# EAGLE schematic se2 (EAGLE 7.2.0)
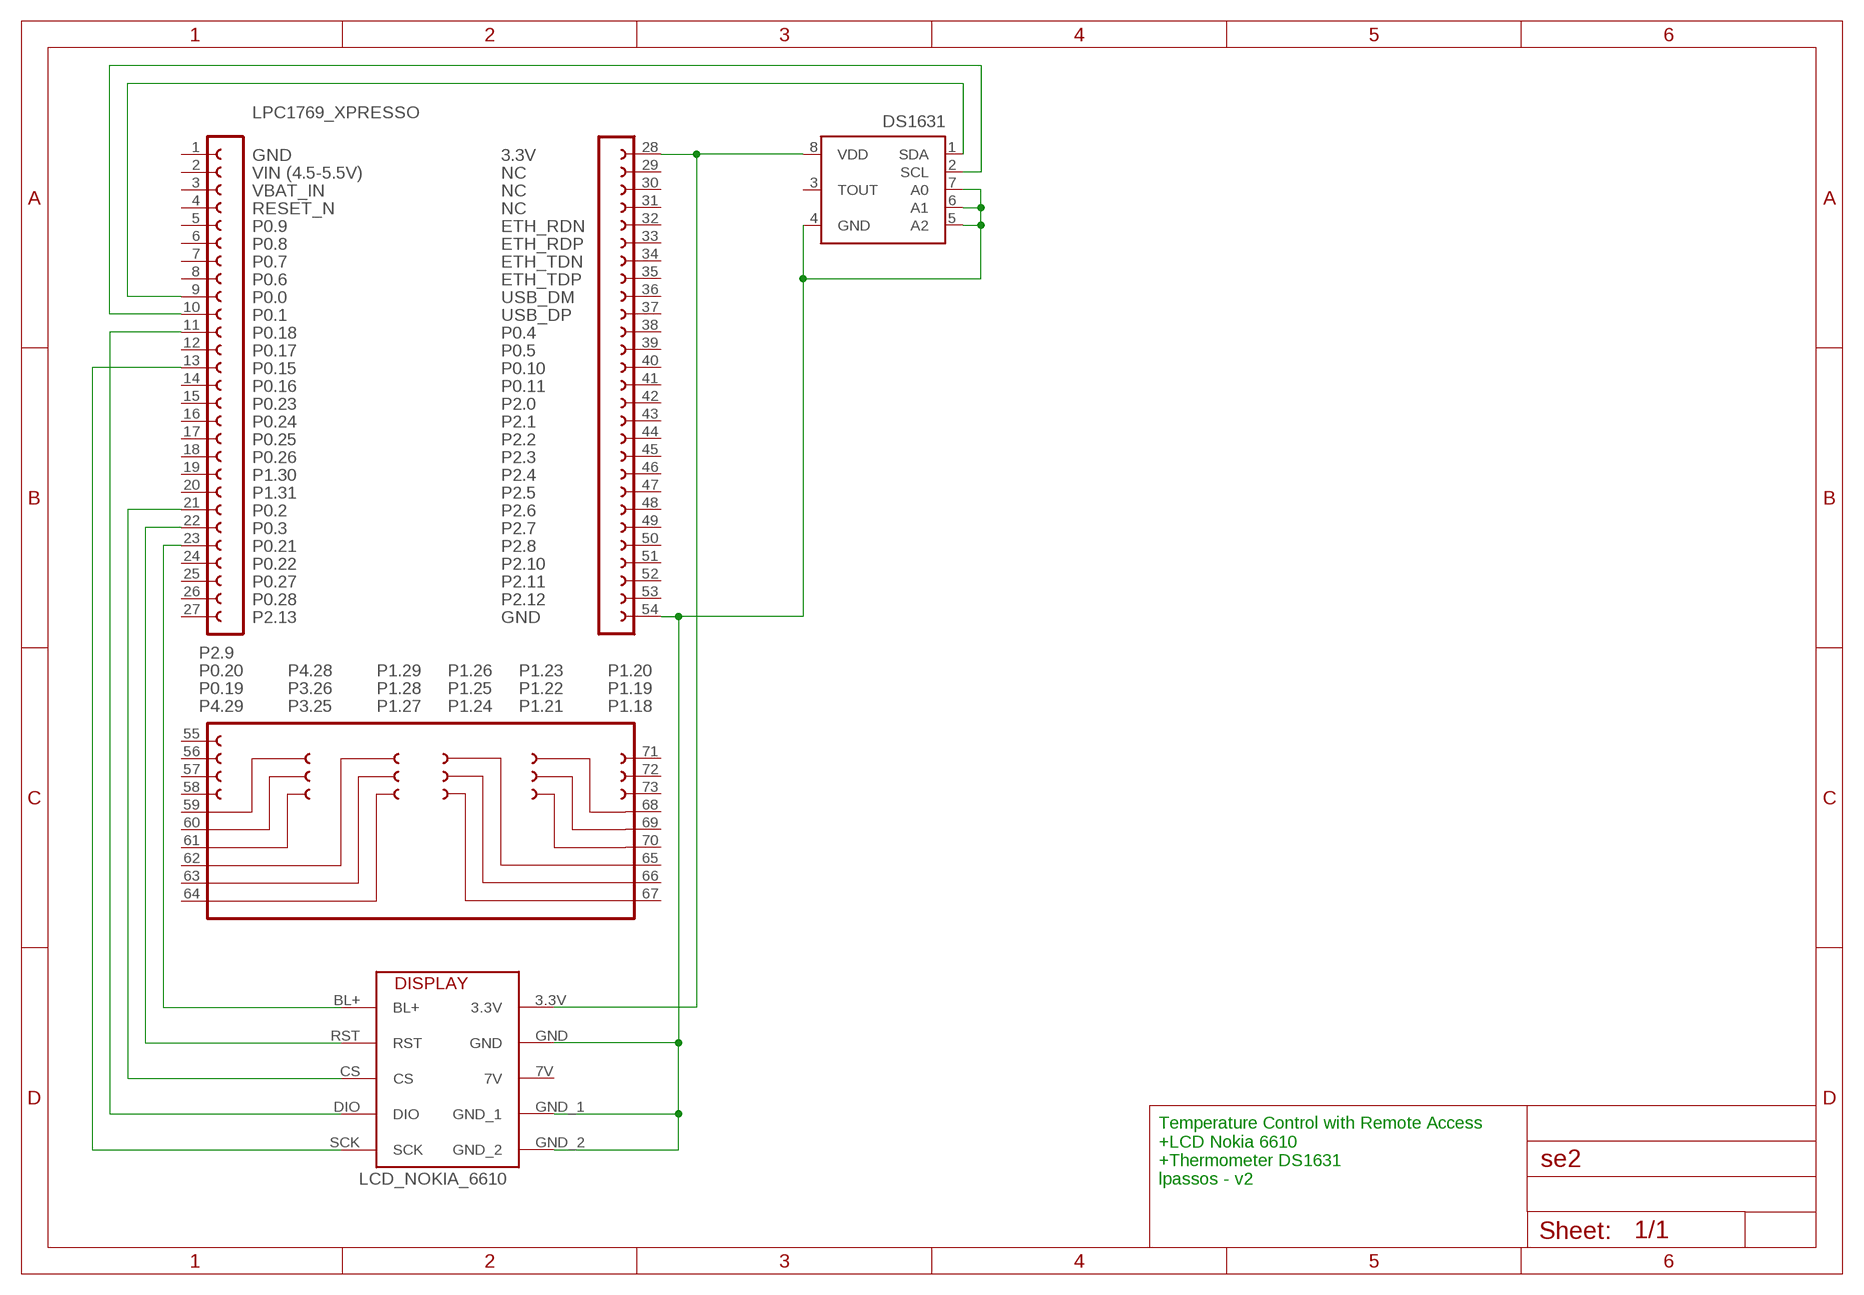
[diagram p0: schematic, sheet 1]

## Parts
DISPLAY  NOKIA_LCD_6610  [LCD_NOKIA_6610]
DS1631  DS1621  [DIL08]
LPC1769_XPRESSO  LPCXPRESSO_LPC1769  [LPCXPRESSO_LPC1769]

## Nets
N$3: DISPLAY.3.3V DS1631.8(VDD) LPC1769_XPRESSO.28
N$4: DISPLAY.BL+ LPC1769_XPRESSO.23
N$5: DISPLAY.RST LPC1769_XPRESSO.22
N$6: DISPLAY.CS LPC1769_XPRESSO.21
N$7: DISPLAY.DIO LPC1769_XPRESSO.11
N$8: DISPLAY.SCK LPC1769_XPRESSO.13
N$9: DISPLAY.GND DISPLAY.GND_1 DISPLAY.GND_2 DS1631.4(GND) DS1631.5(A2) DS1631.6(A1) DS1631.7(A0) LPC1769_XPRESSO.54
N$10: DS1631.1(SDA) LPC1769_XPRESSO.9
N$11: DS1631.2(SCL) LPC1769_XPRESSO.10
Unconnected: DISPLAY.7V DS1631.3(TOUT) LPC1769_XPRESSO.1 LPC1769_XPRESSO.2 LPC1769_XPRESSO.3 LPC1769_XPRESSO.4 LPC1769_XPRESSO.5 LPC1769_XPRESSO.6 LPC1769_XPRESSO.7 LPC1769_XPRESSO.8 LPC1769_XPRESSO.12 LPC1769_XPRESSO.14 LPC1769_XPRESSO.15 LPC1769_XPRESSO.16 LPC1769_XPRESSO.17 LPC1769_XPRESSO.18 LPC1769_XPRESSO.19 LPC1769_XPRESSO.20 LPC1769_XPRESSO.24 LPC1769_XPRESSO.25 LPC1769_XPRESSO.26 LPC1769_XPRESSO.27 LPC1769_XPRESSO.29 LPC1769_XPRESSO.30 LPC1769_XPRESSO.31 LPC1769_XPRESSO.32 LPC1769_XPRESSO.33 LPC1769_XPRESSO.34 LPC1769_XPRESSO.35 LPC1769_XPRESSO.36 LPC1769_XPRESSO.37 LPC1769_XPRESSO.38 LPC1769_XPRESSO.39 LPC1769_XPRESSO.40 LPC1769_XPRESSO.41 LPC1769_XPRESSO.42 LPC1769_XPRESSO.43 LPC1769_XPRESSO.44 LPC1769_XPRESSO.45 LPC1769_XPRESSO.46 LPC1769_XPRESSO.47 LPC1769_XPRESSO.48 LPC1769_XPRESSO.49 LPC1769_XPRESSO.50 LPC1769_XPRESSO.51 LPC1769_XPRESSO.52 LPC1769_XPRESSO.53 LPC1769_XPRESSO.55 LPC1769_XPRESSO.56 LPC1769_XPRESSO.57 LPC1769_XPRESSO.58 LPC1769_XPRESSO.59 LPC1769_XPRESSO.60 LPC1769_XPRESSO.61 LPC1769_XPRESSO.62 LPC1769_XPRESSO.63 LPC1769_XPRESSO.64 LPC1769_XPRESSO.65 LPC1769_XPRESSO.66 LPC1769_XPRESSO.67 LPC1769_XPRESSO.68 LPC1769_XPRESSO.69 LPC1769_XPRESSO.70 LPC1769_XPRESSO.71 LPC1769_XPRESSO.72 LPC1769_XPRESSO.73

## Notes on the sheet
- Temperature Control with Remote Access
  +LCD Nokia 6610
  +Thermometer DS1631
  lpassos - v2

## Library data of the parts
DISPLAY = nokia_lcd6610:NOKIA_LCD_6610
DS1631 = maxim:DS1621: Digital Thermometer and Thermostat Source: http://pdfserv.maxim-ic.com/en/ds/DS1621.pdf; MPN: DS1621; OC_FARNELL: 1188024; OC_NEWARK: 66F3769
LPC1769_XPRESSO = LPCXpresso_boards:LPCXPRESSO_LPC1769; OC_NEWARK: unknown